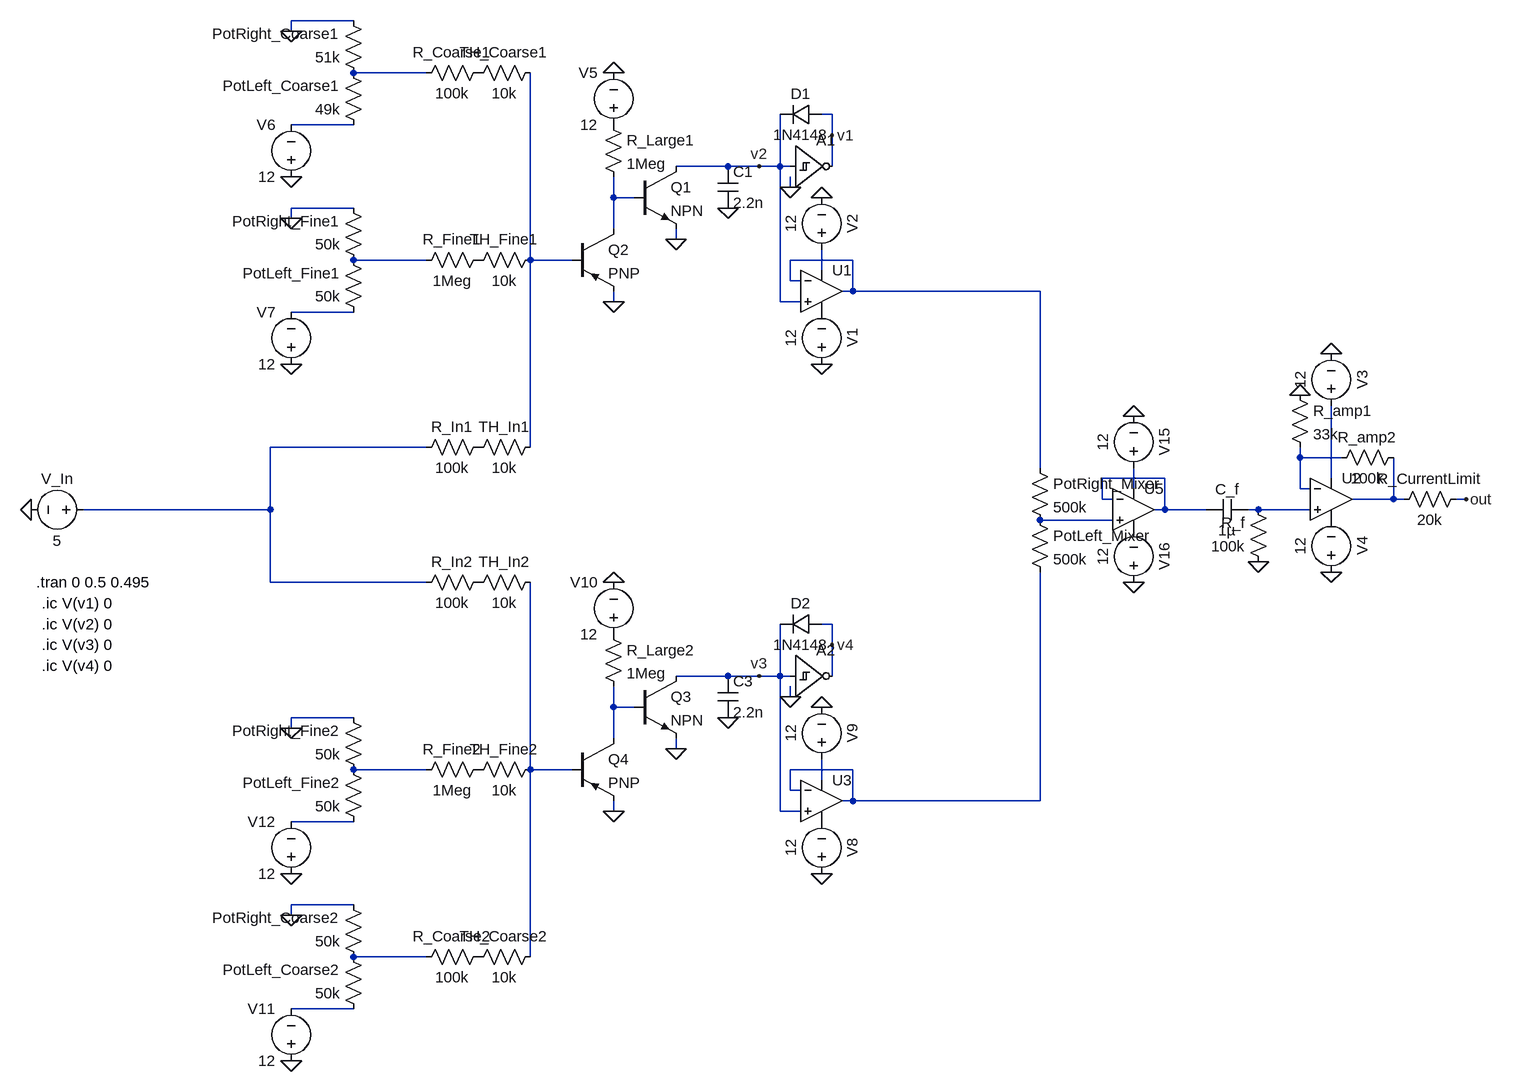
[diagram p0: schematic SPICE simulation.asc]
SPICE simulation.asc, the LTspice schematic file:
Version 4.1
SHEET 1 1408 1484
WIRE -544 -128 -640 -128
WIRE -640 -112 -640 -128
WIRE -432 -48 -544 -48
WIRE 192 16 176 16
WIRE -544 32 -640 32
WIRE 192 48 192 16
WIRE 32 96 -48 96
WIRE 80 96 32 96
WIRE 112 96 112 16
WIRE 112 96 80 96
WIRE 128 96 112 96
WIRE 192 96 192 48
WIRE 128 128 128 112
WIRE -144 144 -144 112
WIRE -112 144 -144 144
WIRE -544 160 -640 160
WIRE -640 176 -640 160
WIRE -144 192 -144 144
WIRE -48 208 -48 192
WIRE -432 240 -544 240
WIRE -272 240 -272 -48
WIRE -208 240 -272 240
WIRE 224 240 128 240
WIRE 176 256 176 224
WIRE 128 272 128 240
WIRE 144 272 128 272
WIRE 224 288 224 240
WIRE 224 288 208 288
WIRE 512 288 224 288
WIRE -144 304 -144 288
WIRE 112 304 112 96
WIRE 144 304 112 304
WIRE -544 320 -640 320
WIRE -432 528 -672 528
WIRE -272 528 -272 240
WIRE 912 544 912 528
WIRE 976 544 912 544
WIRE 512 560 512 288
WIRE 704 576 608 576
WIRE 960 576 960 464
WIRE 656 592 656 560
WIRE 912 592 912 544
WIRE 928 592 912 592
WIRE 608 608 608 576
WIRE 624 608 608 608
WIRE 1056 608 1056 544
WIRE 1056 608 992 608
WIRE 1072 608 1056 608
WIRE 1168 608 1152 608
WIRE -672 624 -672 528
WIRE -672 624 -960 624
WIRE 704 624 704 576
WIRE 704 624 688 624
WIRE 768 624 704 624
WIRE 848 624 832 624
WIRE 928 624 848 624
WIRE 624 640 512 640
WIRE -672 736 -672 624
WIRE -432 736 -672 736
WIRE 192 800 176 800
WIRE 192 832 192 800
WIRE 32 880 -48 880
WIRE 80 880 32 880
WIRE 112 880 112 800
WIRE 112 880 80 880
WIRE 128 880 112 880
WIRE 192 880 192 832
WIRE 128 912 128 896
WIRE -144 928 -144 896
WIRE -112 928 -144 928
WIRE -544 944 -640 944
WIRE -640 960 -640 944
WIRE -144 976 -144 928
WIRE -48 992 -48 976
WIRE -432 1024 -544 1024
WIRE -272 1024 -272 736
WIRE -208 1024 -272 1024
WIRE 224 1024 128 1024
WIRE 176 1040 176 1008
WIRE 128 1056 128 1024
WIRE 144 1056 128 1056
WIRE 224 1072 224 1024
WIRE 224 1072 208 1072
WIRE 512 1072 512 720
WIRE 512 1072 224 1072
WIRE -144 1088 -144 1072
WIRE 112 1088 112 880
WIRE 144 1088 112 1088
WIRE -544 1104 -640 1104
WIRE -544 1232 -640 1232
WIRE -640 1248 -640 1232
WIRE -432 1312 -544 1312
WIRE -272 1312 -272 1024
WIRE -544 1392 -640 1392
FLAG -48 208 0
FLAG 176 144 0
FLAG 176 400 0
FLAG 192 48 v1
FLAG 80 96 v2
FLAG 1168 608 out
FLAG 848 704 0
FLAG 912 448 0
FLAG 960 384 0
FLAG 960 720 0
FLAG 128 128 0
FLAG 32 160 0
FLAG -144 -48 0
FLAG -144 304 0
FLAG -640 112 0
FLAG -640 -112 0
FLAG -640 176 0
FLAG -640 400 0
FLAG -48 992 0
FLAG 176 928 0
FLAG 176 1184 0
FLAG 192 832 v4
FLAG 80 880 v3
FLAG 128 912 0
FLAG 32 944 0
FLAG -144 736 0
FLAG -144 1088 0
FLAG -640 1472 0
FLAG -640 1248 0
FLAG -640 960 0
FLAG -640 1184 0
FLAG -1040 624 0
FLAG 656 736 0
FLAG 656 480 0
SYMBOL Digital\\schmtinv 128 32 R0
WINDOW 3 8 44 Invisible 2
SYMATTR Value Vhigh=9 Vt=4.45 Vh=.85 Trise=.1u Tfall=.1u
SYMATTR InstName A1
SYMBOL cap 16 96 R0
SYMATTR InstName C1
SYMATTR Value 2.2n
SYMBOL diode 176 0 R90
WINDOW 0 0 32 VBottom 2
WINDOW 3 32 32 VTop 2
SYMATTR InstName D1
SYMATTR Value 1N4148
SYMBOL OpAmps\\UniversalOpAmp2 176 288 R0
SYMATTR InstName U1
SYMBOL voltage 176 416 R180
WINDOW 0 -32 56 VBottom 2
WINDOW 3 32 56 VTop 2
WINDOW 123 0 0 Left 0
WINDOW 39 0 0 Left 0
SYMATTR InstName V1
SYMATTR Value 12
SYMBOL voltage 176 240 R180
WINDOW 0 -32 56 VBottom 2
WINDOW 3 32 56 VTop 2
WINDOW 123 0 0 Left 0
WINDOW 39 0 0 Left 0
SYMATTR InstName V2
SYMATTR Value 12
SYMBOL cap 832 608 R90
WINDOW 0 0 32 VBottom 2
WINDOW 3 32 32 VTop 2
SYMATTR InstName C_f
SYMATTR Value 1µ
SYMBOL res 864 720 R180
WINDOW 0 36 76 Left 2
WINDOW 3 36 40 Left 2
SYMATTR InstName R_f
SYMATTR Value 100k
SYMBOL OpAmps\\UniversalOpAmp2 960 608 R0
SYMATTR InstName U2
SYMBOL res 1072 528 R90
WINDOW 0 0 56 VBottom 2
WINDOW 3 32 56 VTop 2
SYMATTR InstName R_amp2
SYMATTR Value 100k
SYMBOL res 896 432 R0
SYMATTR InstName R_amp1
SYMATTR Value 33k
SYMBOL voltage 960 480 R180
WINDOW 0 -32 56 VBottom 2
WINDOW 3 32 56 VTop 2
WINDOW 123 0 0 Left 0
WINDOW 39 0 0 Left 0
SYMATTR InstName V3
SYMATTR Value 12
SYMBOL voltage 960 736 R180
WINDOW 0 -32 56 VBottom 2
WINDOW 3 32 56 VTop 2
WINDOW 123 0 0 Left 0
WINDOW 39 0 0 Left 0
SYMATTR InstName V4
SYMATTR Value 12
SYMBOL res 1168 592 R90
WINDOW 0 0 56 VBottom 2
WINDOW 3 32 56 VTop 2
SYMATTR InstName R_CurrentLimit
SYMATTR Value 20k
SYMBOL npn -112 96 R0
SYMATTR InstName Q1
SYMBOL res -160 16 R0
SYMATTR InstName R_Large1
SYMATTR Value 1Meg
SYMBOL voltage -144 48 R180
WINDOW 0 24 96 Left 2
WINDOW 3 24 16 Left 2
WINDOW 123 0 0 Left 0
WINDOW 39 0 0 Left 0
SYMATTR InstName V5
SYMATTR Value 12
SYMBOL pnp -208 192 R0
SYMATTR InstName Q2
SYMBOL res -256 224 R90
WINDOW 0 0 56 VBottom 2
WINDOW 3 32 56 VTop 2
SYMATTR InstName TH_Fine1
SYMATTR Value 10k
SYMBOL res -256 -64 R90
WINDOW 0 0 56 VBottom 2
WINDOW 3 32 56 VTop 2
SYMATTR InstName TH_Coarse1
SYMATTR Value 10k
SYMBOL res -336 -64 R90
WINDOW 0 0 56 VBottom 2
WINDOW 3 32 56 VTop 2
SYMATTR InstName R_Coarse1
SYMATTR Value 100k
SYMBOL res -336 224 R90
WINDOW 0 0 56 VBottom 2
WINDOW 3 32 56 VTop 2
SYMATTR InstName R_Fine1
SYMATTR Value 1Meg
SYMBOL res -528 -32 R180
WINDOW 0 36 76 Left 2
WINDOW 3 36 40 Left 2
SYMATTR InstName PotRight_Coarse1
SYMATTR Value 51k
SYMBOL res -528 48 R180
WINDOW 0 36 76 Left 2
WINDOW 3 36 40 Left 2
SYMATTR InstName PotLeft_Coarse1
SYMATTR Value 49k
SYMBOL voltage -640 128 R180
WINDOW 0 24 96 Left 2
WINDOW 3 24 16 Left 2
WINDOW 123 0 0 Left 0
WINDOW 39 0 0 Left 0
SYMATTR InstName V6
SYMATTR Value 12
SYMBOL res -528 256 R180
WINDOW 0 36 76 Left 2
WINDOW 3 36 40 Left 2
SYMATTR InstName PotRight_Fine1
SYMATTR Value 50k
SYMBOL res -528 336 R180
WINDOW 0 36 76 Left 2
WINDOW 3 36 40 Left 2
SYMATTR InstName PotLeft_Fine1
SYMATTR Value 50k
SYMBOL voltage -640 416 R180
WINDOW 0 24 96 Left 2
WINDOW 3 24 16 Left 2
WINDOW 123 0 0 Left 0
WINDOW 39 0 0 Left 0
SYMATTR InstName V7
SYMATTR Value 12
SYMBOL res -256 512 R90
WINDOW 0 0 56 VBottom 2
WINDOW 3 32 56 VTop 2
SYMATTR InstName TH_In1
SYMATTR Value 10k
SYMBOL res -336 512 R90
WINDOW 0 0 56 VBottom 2
WINDOW 3 32 56 VTop 2
SYMATTR InstName R_In1
SYMATTR Value 100k
SYMBOL Digital\\schmtinv 128 816 R0
WINDOW 3 8 44 Invisible 2
SYMATTR Value Vhigh=9 Vt=4.45 Vh=.85 Trise=.1u Tfall=.1u
SYMATTR InstName A2
SYMBOL cap 16 880 R0
SYMATTR InstName C3
SYMATTR Value 2.2n
SYMBOL diode 176 784 R90
WINDOW 0 0 32 VBottom 2
WINDOW 3 32 32 VTop 2
SYMATTR InstName D2
SYMATTR Value 1N4148
SYMBOL OpAmps\\UniversalOpAmp2 176 1072 R0
SYMATTR InstName U3
SYMBOL voltage 176 1200 R180
WINDOW 0 -32 56 VBottom 2
WINDOW 3 32 56 VTop 2
WINDOW 123 0 0 Left 0
WINDOW 39 0 0 Left 0
SYMATTR InstName V8
SYMATTR Value 12
SYMBOL voltage 176 1024 R180
WINDOW 0 -32 56 VBottom 2
WINDOW 3 32 56 VTop 2
WINDOW 123 0 0 Left 0
WINDOW 39 0 0 Left 0
SYMATTR InstName V9
SYMATTR Value 12
SYMBOL npn -112 880 R0
SYMATTR InstName Q3
SYMBOL res -160 800 R0
SYMATTR InstName R_Large2
SYMATTR Value 1Meg
SYMBOL voltage -144 832 R180
WINDOW 0 24 96 Left 2
WINDOW 3 24 16 Left 2
WINDOW 123 0 0 Left 0
WINDOW 39 0 0 Left 0
SYMATTR InstName V10
SYMATTR Value 12
SYMBOL pnp -208 976 R0
SYMATTR InstName Q4
SYMBOL res -256 1008 R90
WINDOW 0 0 56 VBottom 2
WINDOW 3 32 56 VTop 2
SYMATTR InstName TH_Fine2
SYMATTR Value 10k
SYMBOL res -256 1296 R90
WINDOW 0 0 56 VBottom 2
WINDOW 3 32 56 VTop 2
SYMATTR InstName TH_Coarse2
SYMATTR Value 10k
SYMBOL res -336 1296 R90
WINDOW 0 0 56 VBottom 2
WINDOW 3 32 56 VTop 2
SYMATTR InstName R_Coarse2
SYMATTR Value 100k
SYMBOL res -336 1008 R90
WINDOW 0 0 56 VBottom 2
WINDOW 3 32 56 VTop 2
SYMATTR InstName R_Fine2
SYMATTR Value 1Meg
SYMBOL res -528 1328 R180
WINDOW 0 36 76 Left 2
WINDOW 3 36 40 Left 2
SYMATTR InstName PotRight_Coarse2
SYMATTR Value 50k
SYMBOL res -528 1408 R180
WINDOW 0 36 76 Left 2
WINDOW 3 36 40 Left 2
SYMATTR InstName PotLeft_Coarse2
SYMATTR Value 50k
SYMBOL voltage -640 1488 R180
WINDOW 0 24 96 Left 2
WINDOW 3 24 16 Left 2
WINDOW 123 0 0 Left 0
WINDOW 39 0 0 Left 0
SYMATTR InstName V11
SYMATTR Value 12
SYMBOL res -528 1040 R180
WINDOW 0 36 76 Left 2
WINDOW 3 36 40 Left 2
SYMATTR InstName PotRight_Fine2
SYMATTR Value 50k
SYMBOL res -528 1120 R180
WINDOW 0 36 76 Left 2
WINDOW 3 36 40 Left 2
SYMATTR InstName PotLeft_Fine2
SYMATTR Value 50k
SYMBOL voltage -640 1200 R180
WINDOW 0 24 96 Left 2
WINDOW 3 24 16 Left 2
WINDOW 123 0 0 Left 0
WINDOW 39 0 0 Left 0
SYMATTR InstName V12
SYMATTR Value 12
SYMBOL res -256 720 R90
WINDOW 0 0 56 VBottom 2
WINDOW 3 32 56 VTop 2
SYMATTR InstName TH_In2
SYMATTR Value 10k
SYMBOL res -336 720 R90
WINDOW 0 0 56 VBottom 2
WINDOW 3 32 56 VTop 2
SYMATTR InstName R_In2
SYMATTR Value 100k
SYMBOL voltage -944 624 R90
WINDOW 0 -32 56 VBottom 2
WINDOW 3 32 56 VTop 2
WINDOW 123 0 0 Left 0
WINDOW 39 0 0 Left 0
SYMATTR InstName V_In
SYMATTR Value 5
SYMBOL res 496 544 R0
SYMATTR InstName PotRight_Mixer
SYMATTR Value 500k
SYMBOL res 496 624 R0
SYMATTR InstName PotLeft_Mixer
SYMATTR Value 500k
SYMBOL OpAmps\\UniversalOpAmp2 656 624 R0
SYMATTR InstName U5
SYMBOL voltage 656 576 R180
WINDOW 0 -32 56 VBottom 2
WINDOW 3 32 56 VTop 2
WINDOW 123 0 0 Left 0
WINDOW 39 0 0 Left 0
SYMATTR InstName V15
SYMATTR Value 12
SYMBOL voltage 656 752 R180
WINDOW 0 -32 56 VBottom 2
WINDOW 3 32 56 VTop 2
WINDOW 123 0 0 Left 0
WINDOW 39 0 0 Left 0
SYMATTR InstName V16
SYMATTR Value 12
TEXT -1032 736 Left 2 !.tran 0 0.5 0.495
TEXT -1024 768 Left 2 !.ic V(v1) 0
TEXT -1024 800 Left 2 !.ic V(v2) 0
TEXT -1024 832 Left 2 !.ic V(v3) 0
TEXT -1024 864 Left 2 !.ic V(v4) 0

The netlist it stands for:
* SPICE simulation.asc
A1 v2 0 0 0 0 v1 0 0 SCHMITT Vhigh=9 Vt=4.45 Vh=.85 Trise=.1u Tfall=.1u
C1 v2 0 2.2n
D1 v1 v2 1N4148
X§U1 v2 N006 N007 P001 N006 level2 Avol=1Meg GBW=10Meg Slew=10Meg Ilimit=25m Rail=0 Vos=0 En=0 Enk=0 In=0 Ink=0 Rin=500Meg  ; pins In+ In- V+ V- OUT
V1 0 P001 12
V2 N007 0 12
C_f N015 N011 1µ
R_f 0 N015 100k
X§U2 N015 N010 N012 P002 N014 level2 Avol=1Meg GBW=10Meg Slew=10Meg Ilimit=25m Rail=0 Vos=0 En=0 Enk=0 In=0 Ink=0 Rin=500Meg  ; pins In+ In- V+ V- OUT
R_amp2 N014 N010 100k
R_amp1 0 N010 33k
V3 N012 0 12
V4 0 P002 12
R_CurrentLimit out N014 20k
Q1 v2 N003 0 0 NPN
R_Large1 P003 N003 1Meg
V5 P003 0 12
Q2 N003 N005 0 0 PNP
R§TH_Fine1 N005 P004 10k
R§TH_Coarse1 N005 P005 10k
R_Coarse1 P005 N001 100k
R_Fine1 P004 N004 1Meg
R§PotRight_Coarse1 N001 0 51k
R§PotLeft_Coarse1 N002 N001 49k
V6 0 N002 12
R§PotRight_Fine1 N004 0 50k
R§PotLeft_Fine1 N008 N004 50k
V7 0 N008 12
R§TH_In1 N005 P006 10k
R_In1 P006 N009 100k
A2 v3 0 0 0 0 v4 0 0 SCHMITT Vhigh=9 Vt=4.45 Vh=.85 Trise=.1u Tfall=.1u
C3 v3 0 2.2n
D2 v4 v3 1N4148
X§U3 v3 N020 N021 P007 N020 level2 Avol=1Meg GBW=10Meg Slew=10Meg Ilimit=25m Rail=0 Vos=0 En=0 Enk=0 In=0 Ink=0 Rin=500Meg  ; pins In+ In- V+ V- OUT
V8 0 P007 12
V9 N021 0 12
Q3 v3 N017 0 0 NPN
R_Large2 P008 N017 1Meg
V10 P008 0 12
Q4 N017 N019 0 0 PNP
R§TH_Fine2 N019 P009 10k
R§TH_Coarse2 N019 P010 10k
R_Coarse2 P010 N023 100k
R_Fine2 P009 N018 1Meg
R§PotRight_Coarse2 N023 0 50k
R§PotLeft_Coarse2 N024 N023 50k
V11 0 N024 12
R§PotRight_Fine2 N018 0 50k
R§PotLeft_Fine2 N022 N018 50k
V12 0 N022 12
R§TH_In2 N019 P011 10k
R_In2 P011 N009 100k
V_In N009 0 5
R§PotRight_Mixer N006 N016 500k
R§PotLeft_Mixer N016 N020 500k
X§U5 N016 N011 N013 P012 N011 level2 Avol=1Meg GBW=10Meg Slew=10Meg Ilimit=25m Rail=0 Vos=0 En=0 Enk=0 In=0 Ink=0 Rin=500Meg  ; pins In+ In- V+ V- OUT
V15 N013 0 12
V16 0 P012 12
.model D D
.lib standard.dio
.model NPN NPN
.model PNP PNP
.lib standard.bjt
.tran 0 0.5 0.495
.ic V(v1) 0
.ic V(v2) 0
.ic V(v3) 0
.ic V(v4) 0
.lib UniversalOpAmp2.lib
.backanno
.end